# Altium schematic sheet S2C_IOsVIO.SchDoc
size A4; SheetNumber: 15
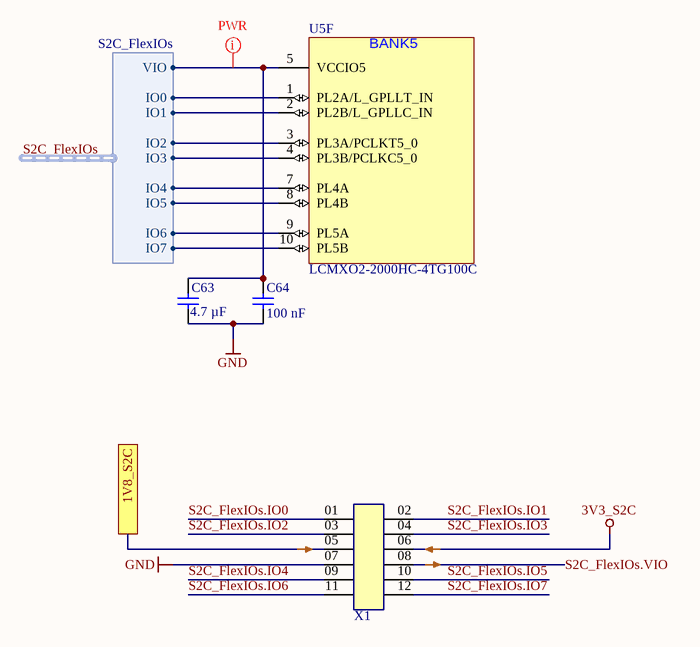
[diagram p0: S2C_IOsVIO.SchDoc]

## Parts
C63  4.7 µF  [C_0603_TE]
C64  100 nF  [C_0603_TE]
U5  LCMXO2-2000HC-4TG100C  [QFP50P1600X1600X160-100N]  (part F of 7)
X1  PH 0.1" SMD 2x06  [TSM-106-01-L-DV]  (value not drawn)

## Ports
1V8_S2C

## Harnesses
S2C_FlexIOs: VIO, IO0, IO1, IO2, IO3, IO4, IO5, IO6, IO7

## Nets
3V3_S2C: X1.06
GND: C63.2 C64.1 X1.07
1V8_S2C: X1.05 ; port 1V8_S2C
S2C_FlexIOs.IO0: U5.1(PL2A/L_GPLLT_IN) ; harness S2C_FlexIOs.IO0
S2C_FlexIOs.IO0: X1.01  [a separate net that carries the same name]
S2C_FlexIOs.IO1: U5.2(PL2B/L_GPLLC_IN) ; harness S2C_FlexIOs.IO1
S2C_FlexIOs.IO1: X1.02  [a separate net that carries the same name]
S2C_FlexIOs.IO2: U5.3(PL3A/PCLKT5_0) ; harness S2C_FlexIOs.IO2
S2C_FlexIOs.IO2: X1.03  [a separate net that carries the same name]
S2C_FlexIOs.IO3: U5.4(PL3B/PCLKC5_0) ; harness S2C_FlexIOs.IO3
S2C_FlexIOs.IO3: X1.04  [a separate net that carries the same name]
S2C_FlexIOs.IO4: U5.7(PL4A) ; harness S2C_FlexIOs.IO4
S2C_FlexIOs.IO4: X1.09  [a separate net that carries the same name]
S2C_FlexIOs.IO5: U5.8(PL4B) ; harness S2C_FlexIOs.IO5
S2C_FlexIOs.IO5: X1.10  [a separate net that carries the same name]
S2C_FlexIOs.IO6: U5.9(PL5A) ; harness S2C_FlexIOs.IO6
S2C_FlexIOs.IO6: X1.11  [a separate net that carries the same name]
S2C_FlexIOs.IO7: U5.10(PL5B) ; harness S2C_FlexIOs.IO7
S2C_FlexIOs.IO7: X1.12  [a separate net that carries the same name]
S2C_FlexIOs.VIO: C63.1 C64.2 U5.5(VCCIO5) ; harness S2C_FlexIOs.VIO
S2C_FlexIOs.VIO: X1.08  [a separate net that carries the same name]

## Layout directives
net class PWR: S2C_FlexIOs.VIO

## Notes on the sheet
- Title
- Revision:
- Design Engineer:
- Date:
- Project:
- Sheet
- of
- (in symbol LCMXO2-2000HC-4TG100C, part F) BANK5

## Library data of the parts
C63 = UZgen_C_0603_4.7uF_16V_X5R: Generic capacitor; Manufacturer: UZgen; Voltage: 16V; Tolerance: 10 %; Created from: MGeier; Manufacturer Part Number: UZgen_C_0603_4.7uF_16V_X5R; PartID: 5809; Created On: 20/03/2025 14:43:45; Value: 4.7 µF; Device Package: 0603; Technology: X5R; Mounting Type: SMD; Last Updated: 20/03/2025 14:43:45
C64 = UZgen_C_0603_100nF_50V_X7R: Generic capacitor; Manufacturer: UZgen; Tolerance: 10 %; Voltage: 50 V; Created from: AGeiger; Value: 100 nF; Technology: X7R; Manufacturer Part Number: UZgen_C_0603_100nF_50V_X7R; PartID: 1; Created On: 02/07/2024 14:42:23; Device Package: 0603; Mounting Type: SMD; Last Updated: 02/08/2024 14:45:57
U5 = LCMXO2-2000HC-4TG100C: TQFP-100(14x14) Programmable Logic Device (CPLDs/FPGAs) ROHS; Manufacturer: Lattice; Created from: FRosner; Manufacturer Part Number: LCMXO2-2000HC-4TG100C; PartID: 37; Created On: 03/07/2024 17:33:36; ComponentLink1Description: Datasheet; ComponentLink1URL: https://wmsc.lcsc.com/wmsc/upload/file/pdf/v2/lcsc/2403111456_Lattice-LCMXO2-2000HC-4TG100C_C1521632.pdf; Component Type: CPLD; Device Package: TQFP-100; Last Updated: 23/08/2024 11:42:29; Mounting Type: SMD; Operating Temperature: -0 to +85 °C; Supplier 1: LCSC; Supplier Part Number 1: C1521632; Supplier 2: Mouser; Supplier Part Number 2: 842-XO22000HC4TG100C; Type: CPLD; Live Cycle Status: 1; LCSC Part Number: C1521632; Stock number: not stored
X1 = UZgen_Conn_PinHead_2x06_SMD_100mil_90deg: 0.1" Double-row Pin Header, 90°-to-PCB SMD, 2x06 Pins, 250V, 3A; Manufacturer: UZgen; Pin Pitch: 0.1" x 0.1"; Pin Orientation: 90° (standing); Created from: UZgenTool; Manufacturer Part Number: UZgen_Conn_PinHead_2x06_SMD_100mil_90deg; PartID: 5; Created On: 18/02/2025 11:27:30; Value: PH 0.1" SMD 2x06; Device Package: SMD 0.1" 2x06; Pin Count: 12; Pin Layout: 2x06; Pin Voltage: 250V; Pin Current: 3A; Mounting Type: SMD; Last Updated: 18/02/2025 11:27:30